# EAGLE design XR2206+FreqMulti (EAGLE 7.2.0)
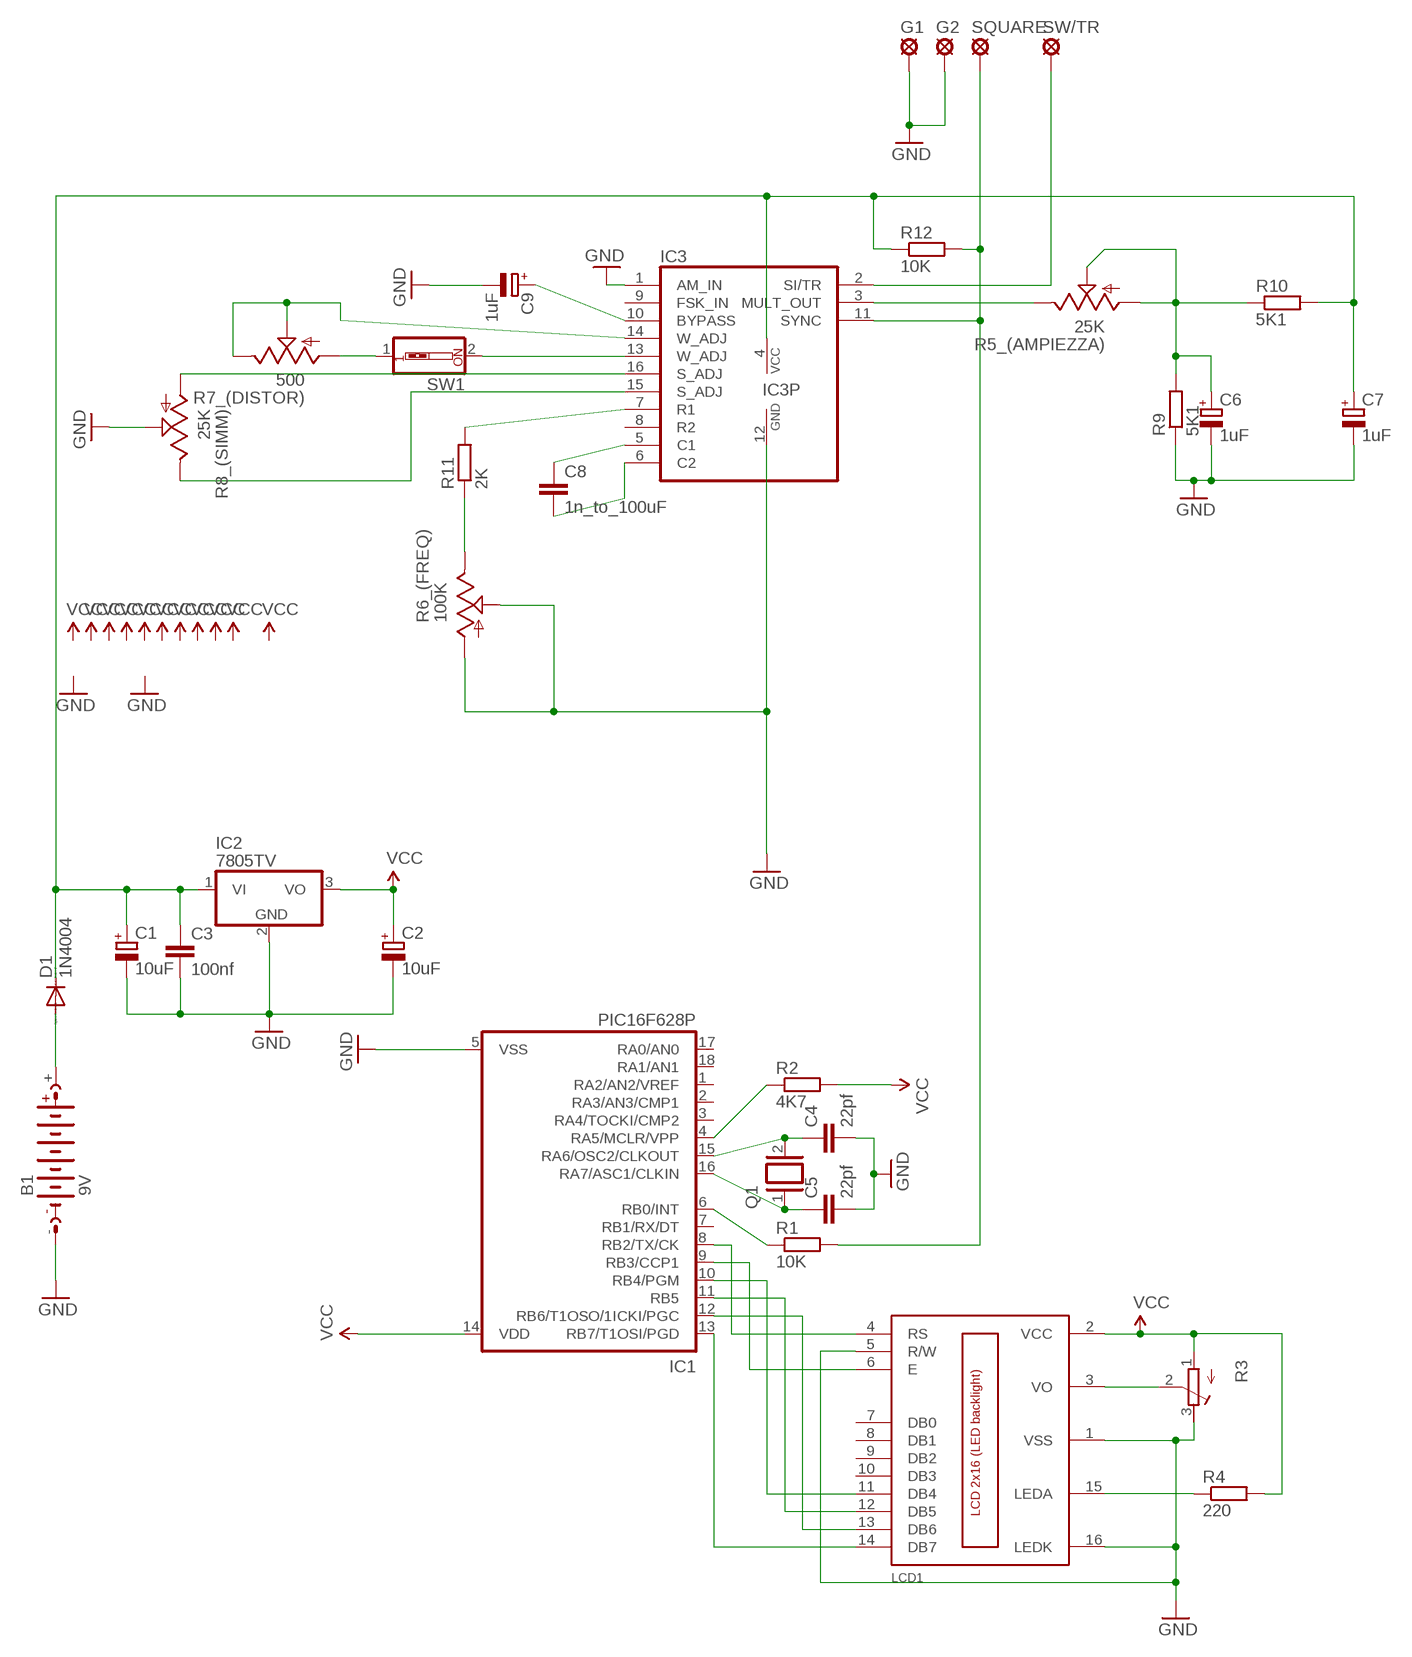
[diagram p0: schematic, sheet 1]

## Parts
B1  9V  AB9V  [AB9V]
C1  10uF  CPOL-EUE2-4  [E2-4]
C2  10uF  CPOL-EUE2-4  [E2-4]
C3  100nf  C-EU050-025X075  [C050-025X075]
C4  22pf  C-EU050-025X075  [C050-025X075]
C5  22pf  C-EU050-025X075  [C050-025X075]
C6  1uF  CPOL-EUE2,5-6E  [E2,5-6E]
C7  1uF  CPOL-EUE2,5-6E  [E2,5-6E]
C8  1n_to_100uF  C-EU050-030X075  [C050-030X075]
C9  1uF  CPOL-EUE2,5-6E  [E2,5-6E]
D1  1N4004  [DO41-10]
G1  LSP10  [LSP10]
G2  LSP10  [LSP10]
IC1  PIC16F628P  [DIL18]
IC2  7805TV  [TO220V]
IC3  XR-2206  [DIL16]
LCD1  LCD_2X16  [HY-1602F]
Q1  XTAL/S  [QS]
R1  10K  R-EU_0207/12  [0207/12]
R2  4K7  R-EU_0207/12  [0207/12]
R3  R-TRIMM3339P  [RTRIM3339P]
R4  220  R-EU_0207/12  [0207/12]
R5_(AMPIEZZA)  25K  US-EVUE2J  [EVUEXXJ]
R6_(FREQ)  100K  US-EVUE2J  [EVUEXXJ]
R7_(DISTOR)  500  US-EVUE2J  [EVUEXXJ]
R8_(SIMM)  25K  US-EVUE2J  [EVUEXXJ]
R9  5K1  R-EU_0207/12  [0207/12]
R10  5K1  R-EU_0207/12  [0207/12]
R11  2K  R-EU_0207/12  [0207/12]
R12  10K  R-EU_0207/12  [0207/12]
SQUARE  LSP10  [LSP10]
SW1  SW_DIP-1  [EDG-01]
SW/TR  LSP10  [LSP10]

## Nets
N$1: LCD1.15(LEDA) R4.1
N$2: C4.1 IC1.15(RA6/OSC2/CLKOUT) Q1.2
N$3: C5.1 IC1.16(RA7/ASC1/CLKIN) Q1.1
N$4: IC1.6(RB0/INT) R1.1
N$5: IC1.4(RA5/MCLR/VPP) R2.1
N$6: B1.+ D1.A
N$7: C9.+ IC3.10(BYPASS)
N$8: IC1.8(RB2/TX/CK) LCD1.4(RS)
N$9: IC1.9(RB3/CCP1) LCD1.6(E)
N$10: IC3.11(SYNC) R1.2 R12.2 SQUARE.MP
N$11: LCD1.3(VO) R3.2(S)
N$12: IC1.10(RB4/PGM) LCD1.11(DB4)
N$13: IC1.11(RB5) LCD1.12(DB5)
N$14: IC1.12(RB6/T1OSO/1ICKI/PGC) LCD1.13(DB6)
N$15: IC1.13(RB7/T1OSI/PGD) LCD1.14(DB7)
N$19: C8.1 IC3.5(C1)
N$20: C8.2 IC3.6(C2)
N$21: IC3.7(R1) R11.2
N$22: R6_(FREQ).3(E) R11.1
N$24: IC3.13(W_ADJ) SW1.2
N$25: B1.- C1.- C2.- C3.2 C4.2 C5.2 C6.- C7.- C9.- G1.MP G2.MP IC1.5(VSS) IC2.2(GND) IC3.1(AM_IN) IC3.12(GND) LCD1.1(VSS) LCD1.5(R/W) LCD1.16(LEDK) R3.3(E) R6_(FREQ).1(A) R6_(FREQ).2(S) R8_(SIMM).2(S) R9.1 ; supply symbol labelled GND
N$26: R7_(DISTOR).1(A) SW1.1
N$27: IC3.14(W_ADJ) R7_(DISTOR).2(S) R7_(DISTOR).3(E)
N$28: IC3.16(S_ADJ) R8_(SIMM).1(A)
N$29: IC3.15(S_ADJ) R8_(SIMM).3(E)
N$30: IC3.2(SI/TR) SW/TR.MP
N$47: C2.+ IC2.3(VO) LCD1.2(VCC) R2.2 R3.1(A) R4.2 ; supply symbol labelled VCC
N$48: C1.+ C3.1 C7.+ D1.C IC2.1(VI) IC3.4(VCC) R10.2 R12.1
N$50: C6.+ R5_(AMPIEZZA).1(A) R5_(AMPIEZZA).2(S) R9.2 R10.1
N$51: IC3.3(MULT_OUT) R5_(AMPIEZZA).3(E)
VCC: IC1.14(VDD)
Unconnected: IC1.1(RA2/AN2/VREF) IC1.2(RA3/AN3/CMP1) IC1.3(RA4/TOCKI/CMP2) IC1.7(RB1/RX/DT) IC1.17(RA0/AN0) IC1.18(RA1/AN1) IC3.8(R2) IC3.9(FSK_IN) LCD1.7(DB0) LCD1.8(DB1) LCD1.9(DB2) LCD1.10(DB3)

## Library data of the parts
B1 = battery:AB9V: 9-V BATTERY CLIP
C1 C2 C6 C7 C9 = rcl:CPOL-EU: POLARIZED CAPACITOR, European symbol
C3-C5 C8 = rcl:C-EU: CAPACITOR, European symbol
D1 = diode:1N4004: DIODE general purpose rectifier, 1 A
G1 G2 SQUARE SW/TR = solpad:LSP10: SOLDER PAD drill 1.0 mm, distributor Buerklin, 12H555
IC1 = microchip:PIC16*F62: FLASH-Based 8-Bit CMOS Microcontroller Source: http://ww1.microchip.com/downloads/en/DeviceDoc/40300C.pdf; MF: MICROCHIP; MPN: PIC16F628-20/P; OC_FARNELL: 9760423; OC_NEWARK: 23C4982
IC2 = linear:78*: Positive VOLTAGE REGULATOR Source: http://cache.national.com/ds/LM/LM78L05.pdf http://www.fairchildsemi.com/ds/LM/LM7805.pdf
IC3 = exar:XR-2206: Monolithic FUNCTION GENERATOR; OC_FARNELL: unknown; OC_NEWARK: unknown
LCD1 = lcd_2x16_HD44780_led_backlight:LCD_2X16
Q1 = special:XTAL/S: CRYSTAL
R1 R2 R4 R9-R12 = rcl:R-EU_: RESISTOR, European symbol
R3 = rcl:R-TRIMM: Trimm resistor
R5_(AMPIEZZA) R6_(FREQ) R7_(DISTOR) R8_(SIMM) = pot:US-EVU: 9 mm Square Rotary Potentiometers Source: Panasonic
SW1 = special:SW_DIP-1: DIP SWITCH

## Board
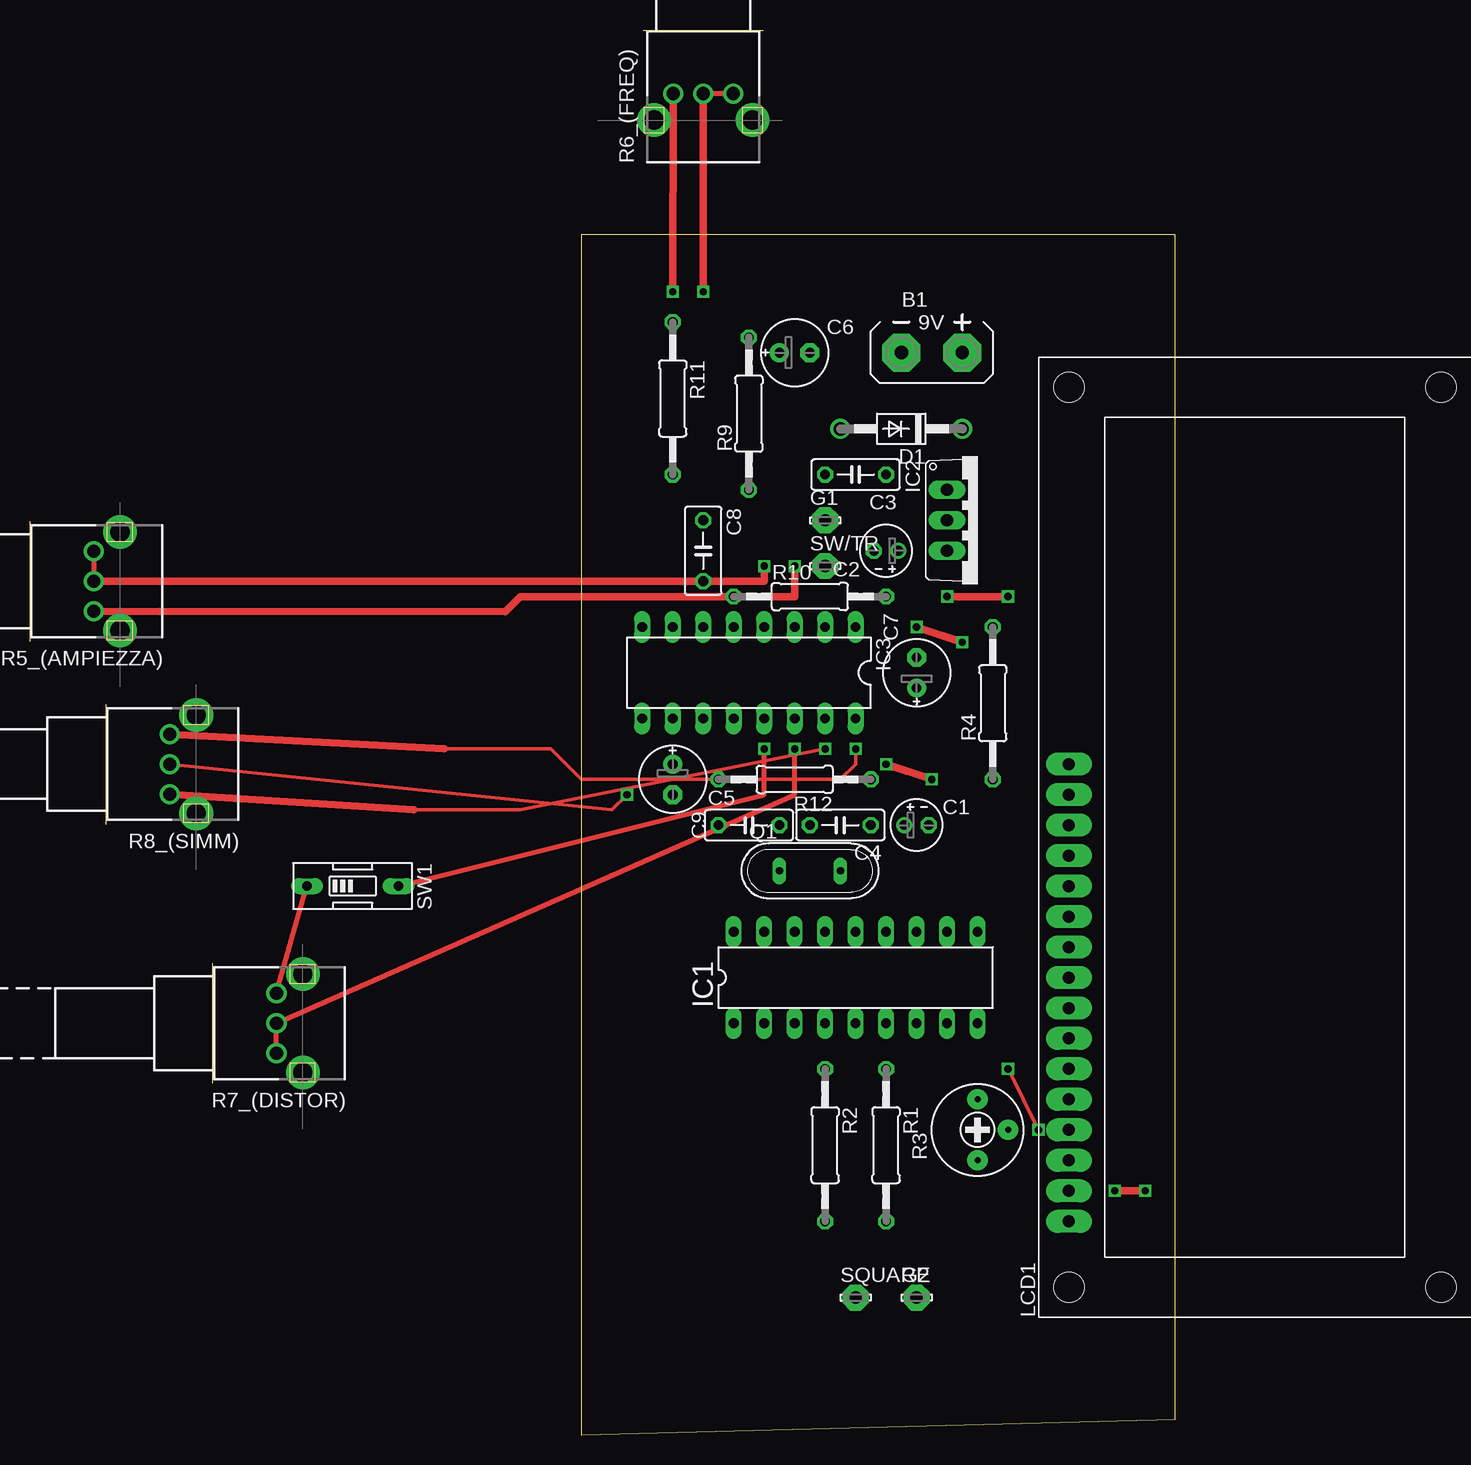
[diagram p1: board, top side]
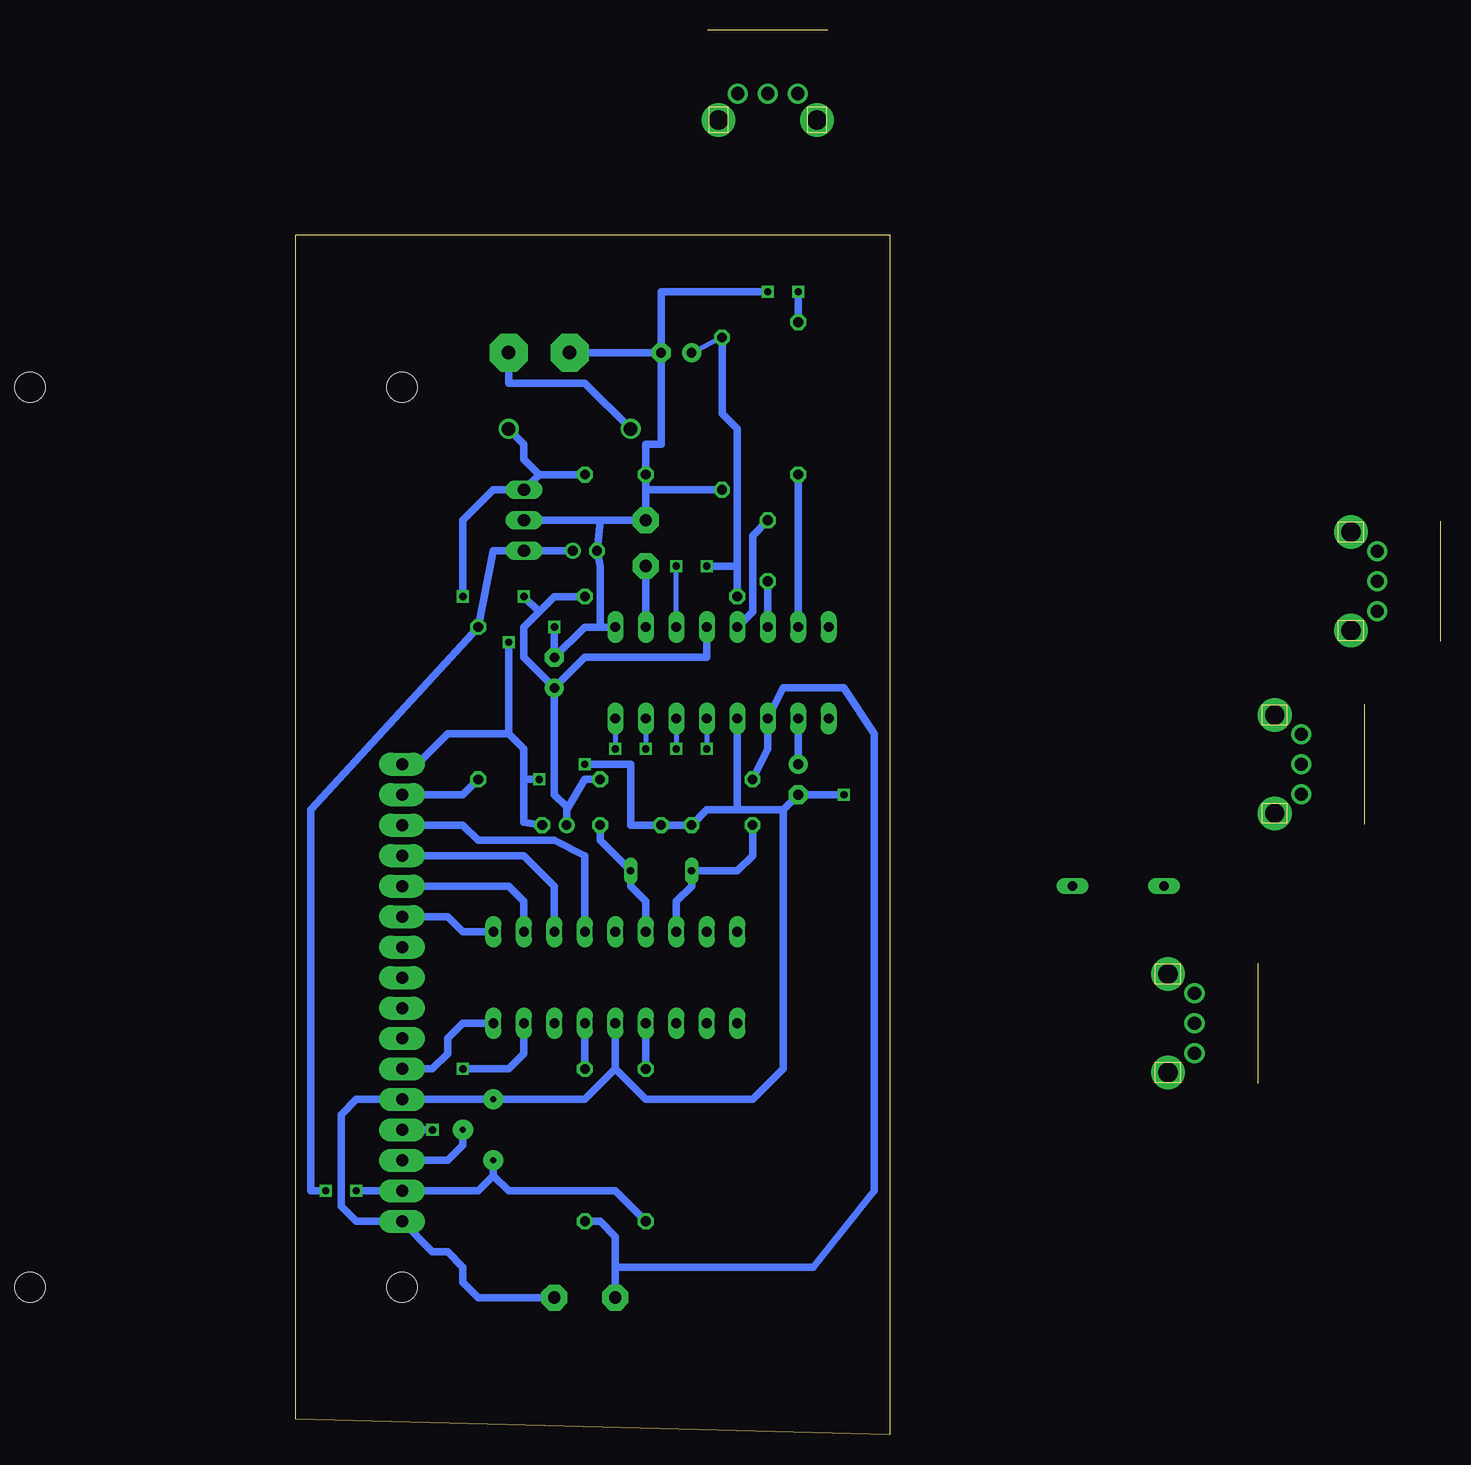
[diagram p2: board, bottom side, seen from below]

Size 95.45 x 117.06 mm. Coordinates in mm from the lower left corner, seen from the top.
Outline: 45.94,0 95.45,1.27 95.45,100 45.94,100 45.94,0
Copper layers (1*16): Top 0.035mm / dielectric 1.5mm / Bottom 0.035mm
Design rules "default": minimum track width 10mil, minimum drill 24mil, track to track 8mil, track to pad 8mil, pad to pad 8mil, via to via 8mil, smd to smd 8mil, copper to edge 40mil, drill to drill 8mil, minimum pad ring 10mil, minimum via ring 8mil, stop-mask expansion 4mil, vias tented up to drill 0mil, thermal gap 10mil

### Footprints (pad centres in the part's own frame; a part is rotated, then mirrored left to right if it is on the bottom)
AB9V = drill 1.118 pad 3.15 octagon: + 0,2.54; - 0,-2.54
E2-4 = drill 0.813 pad 1.27: + -1.016,0 | drill 0.813 pad 1.27 octagon: - 1.016,0
C050-025X075 = drill 0.813 octagon: 1 -2.54,0; 2 2.54,0
E2,5-6E = drill 0.813 pad 1.575: + -1.27,0 | drill 0.813 pad 1.575 octagon: - 1.27,0
C050-030X075 = drill 0.813 octagon: 1 -2.54,0; 2 2.54,0
DO41-10 = drill 1.118: A 5.08,0; C -5.08,0
LSP10 = drill 1.016 pad 2.159 octagon: MP 0,0
DIL18 = drill 0.813 long: 1 -10.16,-3.81; 2 -7.62,-3.81; 3 -5.08,-3.81; 4 -2.54,-3.81; 5 0,-3.81; 6 2.54,-3.81; 7 5.08,-3.81; 8 7.62,-3.81; 9 10.16,-3.81; 10 10.16,3.81; 11 7.62,3.81; 12 5.08,3.81; 13 2.54,3.81; 14 0,3.81; 15 -2.54,3.81; 16 -5.08,3.81; 17 -7.62,3.81; 18 -10.16,3.81
TO220V = drill 1.016 long: 1 -2.54,-2.54; 2 0,-2.54; 3 2.54,-2.54
DIL16 = drill 0.813 long: 1 -8.89,-3.81; 2 -6.35,-3.81; 3 -3.81,-3.81; 4 -1.27,-3.81; 5 1.27,-3.81; 6 3.81,-3.81; 7 6.35,-3.81; 8 8.89,-3.81; 9 8.89,3.81; 10 6.35,3.81; 11 3.81,3.81; 12 1.27,3.81; 13 -1.27,3.81; 14 -3.81,3.81; 15 -6.35,3.81; 16 -8.89,3.81
HY-1602F = drill 1 pad 1.93 long: 1 2.54,0; 2 5.08,0; 3 7.62,0; 4 10.16,0; 5 12.7,0; 6 15.24,0; 7 17.78,0; 8 20.32,0; 9 22.86,0; 10 25.4,0; 11 27.94,0; 12 30.48,0; 13 33.02,0; 14 35.56,0; 15 38.1,0; 16 40.64,0 | hole 2.5: -2.96,0; 72.04,0; -2.96,-31; 72.04,-31
QS = drill 0.61 long: 1 -2.54,0; 2 2.54,0
0207/12 = drill 0.813 octagon: 1 -6.35,0; 2 6.35,0
RTRIM3339P = drill 0.5 pad 1.676: 1 -2.54,0; 2 0,-2.54; 3 2.54,0
EVUEXXJ = drill 1.1 pad 1.676: 1 0,-2.5; 2 0,0; 3 0,2.5 | drill 1.6 pad 2.8: M1 -2.2,4.1; M2 -2.2,-4.1
EDG-01 = drill 0.813 long: 1 0,-3.81; 2 0,3.81

### Placement (x,y rotation side)
B1  75.15,90.17 270 top
C1  73.88,50.8 0 top
C2  71.34,73.66 180 top
C3  68.8,80.01 180 top
C4  67.53,50.8 180 top
C5  59.91,50.8 0 top
C6  63.72,90.17 0 top
C7  73.88,63.5 90 top
C8  56.1,73.66 270 top
C9  53.56,54.61 270 top
D1  72.61,83.82 180 top
G1  66.26,76.2 0 top
G2  73.88,11.43 0 top
IC1  68.8,38.1 0 top
IC2  78.96,76.2 270 top
IC3  59.91,63.5 180 top
LCD1  86.58,15.24 90 top
Q1  64.99,46.99 0 top
R1  71.34,24.13 270 top
R2  66.26,24.13 270 top
R3  78.96,25.4 90 top
R4  80.23,60.96 90 top
R5_(AMPIEZZA)  5.3,71.12 180 top
R6_(FREQ)  56.1,111.76 90 top
R7_(DISTOR)  20.54,34.29 180 top
R8_(SIMM)  11.65,55.88 180 top
R9  59.91,85.09 90 top
R10  64.99,69.85 0 top
R11  53.56,86.36 270 top
R12  63.72,54.61 180 top
SQUARE  68.8,11.43 0 top
SW1  26.89,45.72 270 top
SW/TR  66.26,72.39 0 top

### Tracks (layer width: path | path; a pad name or v marks a point on that pad's centre or on a via)
N$1
  Bottom 0.61: LCD1.15 81.5,53.34 R4.1
N$2
  Bottom 0.61: IC1.15 66.26,44.45 67.53,45.72 Q1.2 70.07,49.53 C4.1
N$3
  Bottom 0.61: IC1.16 63.72,44.45 62.45,45.72 Q1.1 58.64,46.99 57.37,48.26 C5.1
N$4
  Bottom 0.61: IC1.6 R1.1
N$5
  Bottom 0.61: IC1.4 R2.1
N$6
  Bottom 0.61: D1.A 71.34,87.63 77.69,87.63 B1.+
N$7
  Bottom 0.61: IC3.10 C9.+
N$8  (via drill 0.6 pad 0.81)
  Top 0.305: v81.5,30.48 v84.04,25.4
  Bottom 0.61: LCD1.4 v84.04,25.4 | IC1.8 76.42,31.75 77.69,30.48 v81.5,30.48
N$9
  Bottom 0.61: LCD1.6 84.04,30.48 82.77,31.75 82.77,33.02 81.5,34.29 IC1.9
N$10
  Bottom 0.61: SQUARE.MP 68.8,13.97 | 68.8,13.97 68.8,16.51 70.07,17.78 R1.2 | 68.8,13.97 52.29,13.97 47.21,20.32 47.21,58.42 49.75,62.23 54.83,62.23 IC3.11 56.1,57.15 R12.2
N$11
  Bottom 0.61: R3.2 81.5,24.13 82.77,22.86 LCD1.3
N$12
  Bottom 0.61: IC1.10 81.5,41.91 82.77,43.18 LCD1.11
N$13
  Bottom 0.61: IC1.11 76.42,44.45 77.69,45.72 LCD1.12
N$14
  Bottom 0.61: IC1.12 73.88,45.72 76.42,48.26 LCD1.13
N$15
  Bottom 0.61: IC1.13 71.34,48.26 73.88,49.53 80.23,49.53 81.5,50.8 LCD1.14
N$19
  Bottom 0.61: C8.1 57.37,74.93 57.37,68.58 IC3.5
N$20
  Bottom 0.61: IC3.6 C8.2
N$21
  Bottom 0.61: IC3.7 R11.2
N$22  (via drill 0.6 pad 0.81)
  Top 0.61: v53.56,95.25 R6_(FREQ).3
  Bottom 0.61: R11.1 v53.56,95.25
N$24  (via drill 0.6 pad 0.81)
  Top 0.406: SW1.2 61.18,53.34 v61.18,57.15
  Bottom 0.406: IC3.13 v61.18,57.15
N$25  (via drill 0.6 pad 0.81)
  Top 0.305: R8_(SIMM).2 48.48,52.07 v49.75,53.34
  Top 0.406: R6_(FREQ).1 R6_(FREQ).2
  Top 0.61: v73.88,67.31 v77.69,66.04 | v71.34,55.88 v75.15,54.61 | v56.1,95.25 R6_(FREQ).2
  Bottom 0.61: 68.8,30.48 71.34,27.94 R3.3 LCD1.5 90.39,27.94 91.66,26.67 91.66,19.05 90.39,17.78 LCD1.1 84.04,15.24 82.77,15.24 81.5,13.97 81.5,12.7 80.23,11.43 G2.MP | C6.- 64.99,82.55 66.26,82.55 C3.2 66.26,78.74 | IC3.1 70.07,67.31 | 70.07,67.31 71.34,67.31 C7.- v73.88,67.31 | C1.- 76.42,51.05 76.42,54.61 | 76.42,54.61 76.42,57.15 77.69,58.42 | 77.69,58.42 82.77,58.42 85.31,55.88 LCD1.16 | 54.83,52.07 C9.- v49.75,53.34 | 54.83,52.07 58.64,52.07 | 58.64,52.07 61.18,52.07 C5.2 C4.2 67.53,50.8 67.53,55.88 v71.34,55.88 | v77.69,66.04 77.69,58.42 | v75.15,54.61 76.42,54.61 | IC3.12 58.64,52.07 | B1.- C6.- | C6.- 64.99,95.25 v56.1,95.25 | 70.07,67.31 70.07,72.39 C2.- 70.07,76.2 | 70.07,76.2 G1.MP 66.26,78.74 | 70.07,76.2 IC2.2 | R9.1 66.26,78.74 | IC1.5 68.8,30.48 | 68.8,30.48 66.26,27.94 57.37,27.94 54.83,30.48 54.83,52.07
N$26
  Top 0.406: R7_(DISTOR).1 SW1.1
N$27  (via drill 0.6 pad 0.81)
  Top 0.406: R7_(DISTOR).3 R7_(DISTOR).2 63.72,53.34 v63.72,57.15
  Bottom 0.406: IC3.14 v63.72,57.15
N$28  (via drill 0.6 pad 0.81)
  Top 0.305: v68.8,57.15 68.8,55.88 67.53,54.61 45.94,54.61 43.4,57.15 34.51,57.15 31.97,57.15
  Top 0.61: R8_(SIMM).1 34.51,57.15
  Bottom 0.406: IC3.16 v68.8,57.15
N$29  (via drill 0.6 pad 0.81)
  Top 0.305: v66.26,57.15 40.86,52.07 31.97,52.07
  Top 0.61: R8_(SIMM).3 31.97,52.07
  Bottom 0.406: IC3.15 v66.26,57.15
N$30
  Bottom 0.61: IC3.2 SW/TR.MP
N$47  (via drill 0.6 pad 0.81)
  Top 0.61: v90.39,20.32 v92.93,20.32
  Bottom 0.61: R2.2 68.8,20.32 77.69,20.32 78.96,21.59 | R3.1 78.96,21.59 | 78.96,21.59 80.23,20.32 LCD1.2 v90.39,20.32 | C2.+ IC2.3 78.96,73.66 R4.2 94.2,52.07 94.2,20.32 v92.93,20.32
N$48  (via drill 0.6 pad 0.81)
  Top 0.61: v76.42,69.85 v81.5,69.85
  Bottom 0.61: C7.+ 73.88,53.34 72.86,52.32 72.86,52.07 | 72.86,52.07 C1.+ | C3.1 75.15,80.01 | 75.15,80.01 IC2.1 78.96,78.74 81.5,76.2 v81.5,69.85 | 75.15,80.01 76.42,81.28 76.42,82.55 D1.C | R10.2 73.88,69.85 75.15,68.58 | 75.15,68.58 76.42,67.31 76.42,64.77 C7.+ | IC3.4 61.18,64.77 71.34,64.77 C7.+ | v76.42,69.85 75.15,68.58 | R12.1 71.34,54.61 72.86,52.07
N$50  (via drill 0.6 pad 0.81)
  Top 0.406: R5_(AMPIEZZA).1 R5_(AMPIEZZA).2
  Top 0.61: R5_(AMPIEZZA).2 61.18,71.12 v61.18,72.39
  Bottom 0.406: R9.2 C6.+
  Bottom 0.61: R10.1 58.64,72.39 | 58.64,72.39 58.64,83.82 59.91,85.09 R9.2 | v61.18,72.39 58.64,72.39
N$51  (via drill 0.6 pad 0.81)
  Top 0.61: v63.72,72.39 63.72,69.85 40.86,69.85 39.59,68.58 R5_(AMPIEZZA).3
  Bottom 0.406: IC3.3 v63.72,72.39